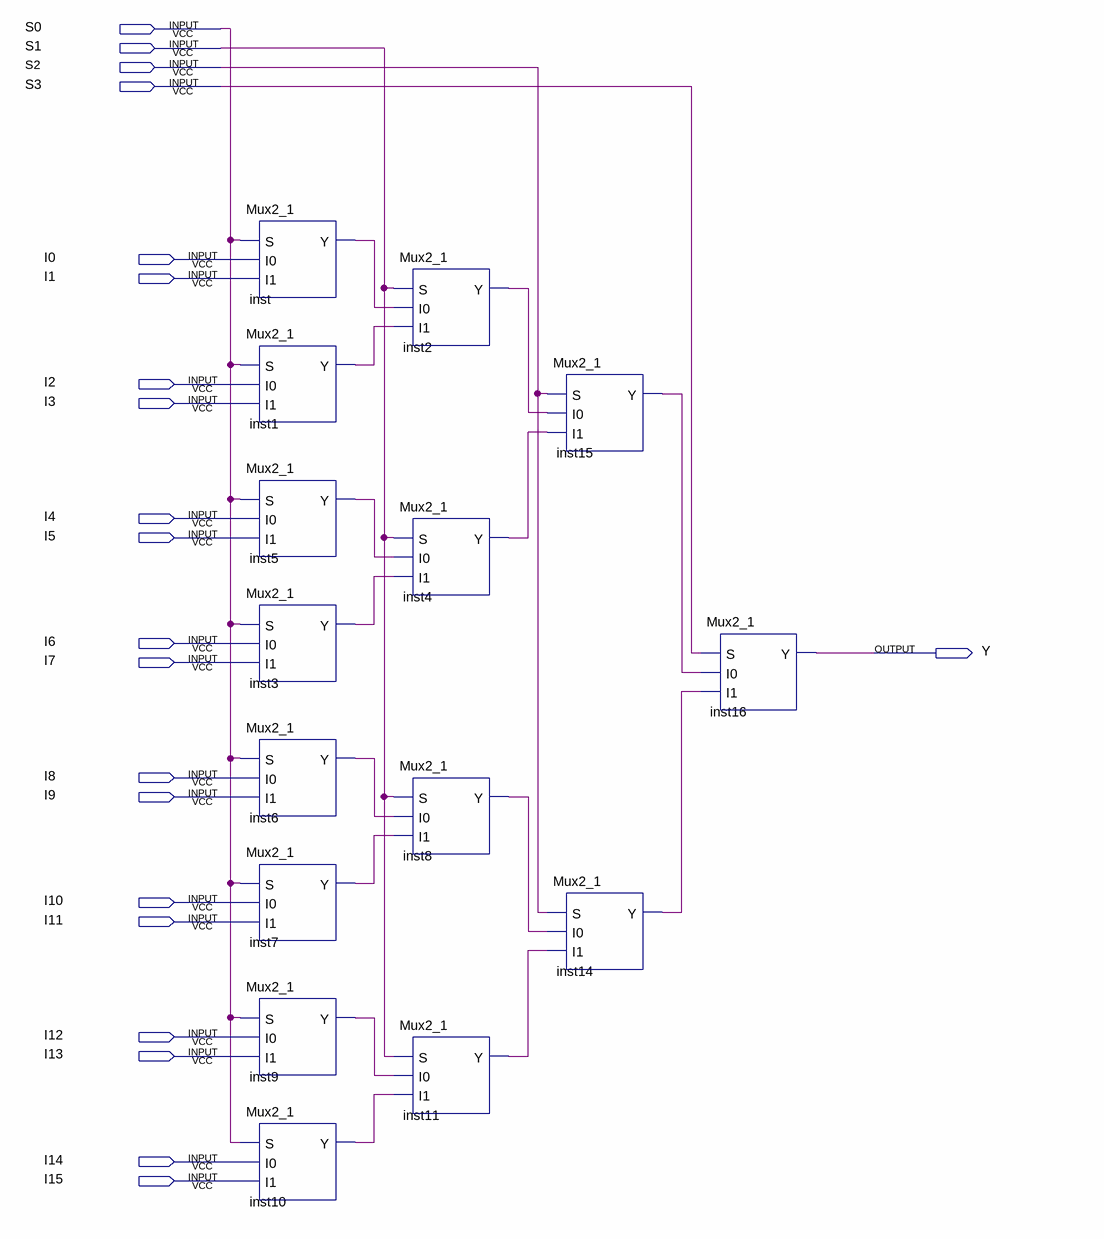
[diagram p0: schematic sheet]
// Quartus schematic Mux16_1.bdf as structural Verilog: 15 symbols, 21 pins
module Mux16_1 (
  input  S0,
  input  S1,
  input  S2,
  input  S3,
  input  I0,
  input  I1,
  input  I2,
  input  I3,
  input  I4,
  input  I5,
  input  I6,
  input  I7,
  input  I8,
  input  I9,
  input  I10,
  input  I11,
  input  I12,
  input  I13,
  input  I14,
  input  I15,
  output Y
);

  wire inst1_y, inst2_y, inst3_y, inst4_y, inst5_y, inst6_y, inst7_y, inst8_y, inst9_y, inst10_y, inst11_y,
       inst14_y, inst15_y, inst_y;

  Mux2_1 inst (.S(S0), .I0(I0), .I1(I1), .Y(inst_y));
  Mux2_1 inst1 (.S(S0), .I0(I2), .I1(I3), .Y(inst1_y));
  Mux2_1 inst5 (.S(S0), .I0(I4), .I1(I5), .Y(inst5_y));
  Mux2_1 inst3 (.S(S0), .I0(I6), .I1(I7), .Y(inst3_y));
  Mux2_1 inst6 (.S(S0), .I0(I8), .I1(I9), .Y(inst6_y));
  Mux2_1 inst7 (.S(S0), .I0(I10), .I1(I11), .Y(inst7_y));
  Mux2_1 inst9 (.S(S0), .I0(I12), .I1(I13), .Y(inst9_y));
  Mux2_1 inst10 (.S(S0), .I0(I14), .I1(I15), .Y(inst10_y));
  Mux2_1 inst2 (.S(S1), .I0(inst_y), .I1(inst1_y), .Y(inst2_y));
  Mux2_1 inst4 (.S(S1), .I0(inst5_y), .I1(inst3_y), .Y(inst4_y));
  Mux2_1 inst8 (.S(S1), .I0(inst6_y), .I1(inst7_y), .Y(inst8_y));
  Mux2_1 inst11 (.S(S1), .I0(inst9_y), .I1(inst10_y), .Y(inst11_y));
  Mux2_1 inst15 (.S(S2), .I0(inst2_y), .I1(inst4_y), .Y(inst15_y));
  Mux2_1 inst14 (.S(S2), .I0(inst8_y), .I1(inst11_y), .Y(inst14_y));
  Mux2_1 inst16 (.S(S3), .I0(inst15_y), .I1(inst14_y), .Y(Y));
endmodule
